# Altium project TutorialBoard.PrjPcb
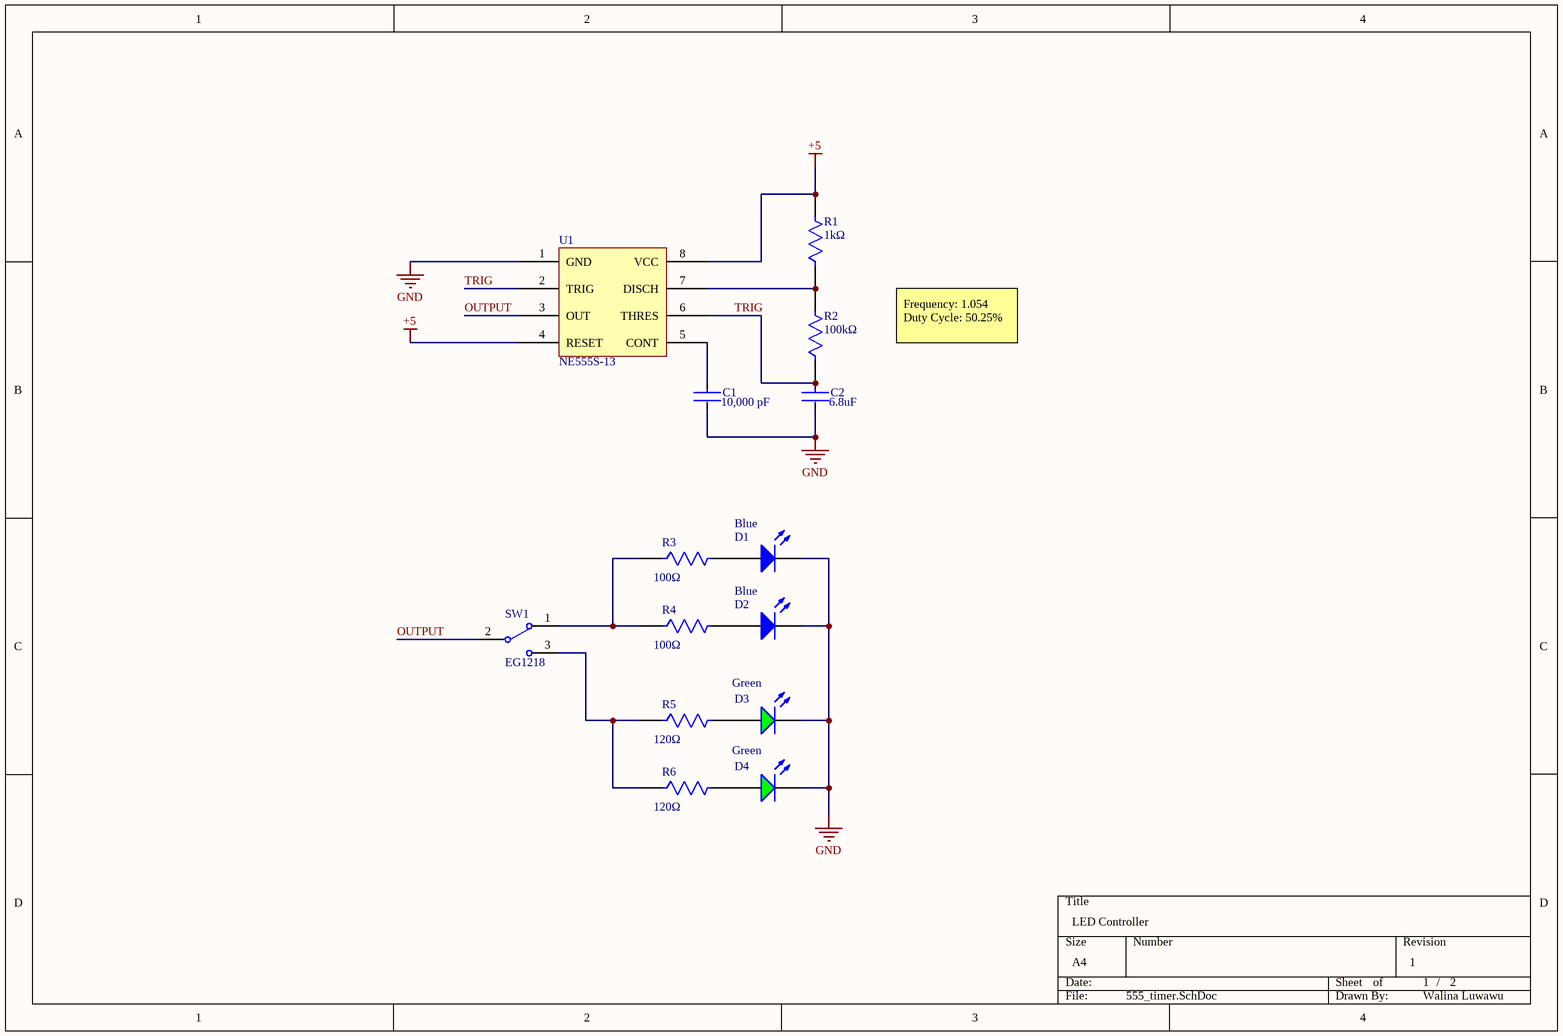
[diagram p0: 555_timer.SchDoc]
2 sheets, 17 parts. Net scope: global (net labels, ports and power ports of the same name join across sheets).
Board file: TutorialBoard.PcbDoc
Sheets:
  555_timer.SchDoc
  Power.SchDoc

## Sheet 555_timer.SchDoc: LED Controller
size A4; DrawnBy: Walina Luwawu; Revision: 1; SheetNumber: 1; SheetTotal: 2

### Parts
C1  Capacitance: 10,000 pF  [FP-C1206C-EB-MFG]  (hidden comment: C1206C103K5RAC7210)
C2  Capacitance: 6.8uF  [FP-CGA4J-IPC_B]  (hidden comment: CGA4J3X7S1A685K125AB)
D1  Color: Blue  [WL-TMRC_D5.9H8.7]  (hidden comment: 151051BS04000)
D2  Color: Blue  [WL-TMRC_D5.9H8.7]  (hidden comment: 151051BS04000)
D3  Color: Green  [WL-TMRC_D3.95H5.3]  (hidden comment: 151031VS06000)
D4  Color: Green  [WL-TMRC_D3.95H5.3]  (hidden comment: 151031VS06000)
R1  Resistance: 1kΩ  [FP-RK73H2A-MFG]  (hidden comment: RK73H2ATTE1001F)
R2  Resistance: 100kΩ  [FP-RR0816-IPC_A]  (hidden comment: RR0816P-104-D)
R3  Resistance: 100Ω  [FP-CR0805-IPC_B]  (hidden comment: CR0805-JW-101ELF)
R4  Resistance: 100Ω  [FP-CR0805-IPC_B]  (hidden comment: CR0805-JW-101ELF)
R5  Resistance: 120Ω  [FP-CRGCQ0805-IPC_C]  (hidden comment: CRGCQ0805F120R)
R6  Resistance: 120Ω  [FP-CRGCQ0805-IPC_C]  (hidden comment: CRGCQ0805F120R)
SW1  EG1218  [ESWI-EG1218_V]
U1  NE555S-13  [NE555S-13]

### Nets
+5: R1.2 U1.4(RESET) U1.8(VCC)
GND: C1.2 C2.2 D1.2(K) D2.2(K) D3.2(K) D4.2(K) U1.1(GND)
OUTPUT: SW1.2(COM) U1.3(OUT)
TRIG: C2.1 R2.1 U1.2(TRIG) U1.6(THRES)
NetC1_1: C1.1 U1.5(CONT)
NetD1_1: D1.1(A) R3.2
NetD2_1: D2.1(A) R4.2
NetD3_1: D3.1(A) R5.2
NetD4_1: D4.1(A) R6.2
NetR1_1: R1.1 R2.2 U1.7(DISCH)
NetR3_1: R3.1 R4.1 SW1.1
NetR5_1: R5.1 R6.1 SW1.3

### Notes on the sheet
- Frequency: 1.054
  Duty Cycle: 50.25%
- /

### Library data of the parts
C1 = CMP-03020-021901-1: CAP CER 10000PF 50V X7R 1206; Manufacturer: KEMET; Description: C1206 10,000 pF X7R 10.00% 50 V; Material: Ceramic; Automotive Grade: Grade 0; Tolerance: 0.1; Temperature Coefficient: 15%; Value: 10,000 pF; ComponentLink2URL: https://content.kemet.com/datasheets/KEM_C1007_X8R_ULTRA_150C_SMD.pdf; Device Class L3: Ceramic Capacitors; Manufacturer Part Number: C1206C103K5RAC7210; Device Class L1: Passive Components; Device Class L2: Capacitors; Digikey Description: CAP CER 10000PF 50V X7R 1206; Temperature Characteristic: X7R; Ipc Land Pattern Name: CAPC320160X78; Automotive: Yes; Voltage Rating: 50 V; Height: 0.88mm; RoHS: TRUE; ComponentLink2Description: Datasheet; Temperature: -55°C to +150°C; Category: Cap; Package: C1206C-EB; Octopart: https://octopart.com/c1206c103k5rac7210-kemet-3918401; Lead Free: Yes; Temperature Range High: +150°C; Temperature Range Low: -55°C; Mouser Description: Multilayer Ceramic Capacitors MLCC - SMD/SMT 50volts 10000pF X7R 10%
C2 = CMP-08246-001055-1: Cap Ceramic 6.8uF 10V X7S 10% Pad SMD 0805 +125°C Automotive T/R; Tolerance: 10%; Height: 1.25mm; Length: 2mm; Min Operating Temperature: -55°C; Case Code (Imperial): 0805; Dielectric: X7S; Case Code (Metric): 2012; Case/Package: 0805; Voltage Rating (DC): 10V; Termination: SMD/SMT; Weight: 0.000194oz; Width: 1.25mm; Max Operating Temperature: 125°C; Package Quantity: 2000; Packaging: Tape and Reel
D1 D2 = CMP-1488-00009-3: Single Color LED, Blue, Diffused, T-1 3/4, 4.9mm; Manufacturer Lifecycle Status: ACTIVE; YEOL: 1 = Estimated lifetime > 10 years; Forward Current: 100mA; Viewing Angle: 40°; Max Reverse Voltage (DC): 5V; Forward Voltage: 3.2V; Lens Size: 5mm; Wavelength: 470nm; Test Current: 20mA; Peak Wavelength: 465nm; Luminous Intensity: 500mcd; Lens Style: Circular, Diffused, Round; Case/Package: Radial; RoHS: Compliant; Width: 5mm; REACH SVHC: Unknown; Max Operating Temperature: 85°C; Mount: Through Hole; Height: 8.6mm; Length: 5mm; Min Operating Temperature: -40°C; Lifecycle Status: Production; Dominant Wavelength: 470nm; Packaging: Bulk
D3 D4 = CMP-1488-00004-3: Led, Green, T-1 (3Mm), 568 Nm, 2.2 V, 30 Ma, 20 Mcd Rohs Compliant: Yes; Manufacturer Lifecycle Status: ACTIVE; Test Current: 20mA; Wavelength: 568nm; Forward Voltage: 2.2V; Viewing Angle: 60°; Lens Style: Circular, Diffused, Round; Max Reverse Voltage (DC): 5V; YEOL: 1 = Estimated lifetime > 10 years; Forward Current: 100mA; Peak Wavelength: 560nm; Luminous Intensity: 30mcd; Case/Package: Radial; Lifecycle Status: Production; Height: 5.3mm; Min Operating Temperature: -40°C; Length: 3mm; RoHS: Compliant; Max Operating Temperature: 85°C; Dominant Wavelength: 568nm; Mount: Through Hole; Lead Free: Lead Free; Lens Size: 3mm; Width: 3mm; Packaging: Bulk; REACH SVHC: Unknown
R1 = CMP-2001-01881-2: 1kΩ ±1% 0.25W Chip Resistor 0805 Thick Film AEC-Q200 Qualified; Manufacturer Series: RK73H; Power Rating: 125mW; Temperature Coefficient: 100ppm/°C; Voltage Rating: 150V; Additional Feature: PRECISION; Package Quantity: 4000; Height: 0.5mm; Construction: Rectangular; Case Code (Imperial): 0805; Size Code: 0805; Length: 2mm; Resistor Type: Thick Film; Min Operating Temperature: -55°C; Packaging: Tape and Reel; Package Shape: Rectangular; Max Operating Temperature: 155°C; Lead Free: Lead Free; Case/Package: 0805; Terminal Finish: Tin; Case Code (Metric): 2012; Military Standard: Not; Series: RK73H; Tolerance: 1%; Depth: 1.25mm; Width: 1.25mm; Technology: METAL GLAZE/THICK FILM; RoHS Compliant: Yes; Termination: SMD/SMT; Working Voltage: 150V
R2 = CMP-2000-02426-2: 100kΩ ±0.5% 0.0625W 1/16W Chip Resistor 0603 (1608 Metric) Thin Film; Max Power Dissipation: 63mW; Working Voltage: 75V; Temperature Coefficient: 25ppm/°C; Technology: THIN FILM; Width: 0.8mm; Length: 1.6mm; Number of Pins: 2; Case Code (Metric): 1608; Tolerance: 0.5%; Case Code (Imperial): 0603; Resistor Type: Thin Film; Voltage Rating (DC): 75V; Lead Free: Lead Free; Max Operating Temperature: 125°C; Series: RR; Voltage Rating: 75V; Termination: SMD/SMT; Depth: 0.8mm; Power Rating: 63mW; Min Operating Temperature: -55°C; Packaging: Tape and Reel; Height: 0.4mm; Package Quantity: 1; RoHS Compliant: Yes; Number of Terminations: 2; Resistance Tolerance: 0.5%; Case/Package: 0603
R3 R4 = CMP-07231-002659-1: Thick Film Chip Resistors 0805 100Ω 0.125W 5% 200ppm/°C; Voltage Rating (DC): 150V; Power Rating: 125mW; Width: 1.25mm; Contact Plating: Tin; Case/Package: 0805; Tolerance: 5%; Termination: SMD/SMT; Case Code (Imperial): 0805; Min Operating Temperature: -55°C; Packaging: Tape and Reel; Height: 0.024inch; REACH SVHC: No SVHC; Composition: Thick Film; Voltage Rating: 150V; Case Code (Metric): 2012; Temperature Coefficient: 200ppm/°C; Max Operating Temperature: 155°C; Mount: Surface Mount; Package Quantity: 1; Features: Moisture Resistant; Max Power Dissipation: 125mW; Military Standard: Not; Depth: 1.25mm; Number of Terminations: 2; Thickness: 508um; Length: 2mm
R5 R6 = CMP-03211-008258-1: CRGCQ 0805 120R 1%; Manufacturer: TE Connectivity; Value: 120Ω; Voltage Rating: 150V; Tolerance: 0.01; Temperature Coefficient: ±100ppm/°C; Description: CRGCQ0805 120Ω 0.125W ±100ppm/°C 1% 150V; Automotive Grade: Grade 473; Power Rating: 0.125W; Device Class L1: Passive Components; Manufacturer Part Number: CRGCQ0805F120R; ComponentLink2Description: Datasheet; Package: CRGCQ0805; ComponentLink2URL: https://www.te.com/commerce/DocumentDelivery/DDEController?Action=showdoc&DocId=Data+Sheet%7F1773204-3%7F1%7Fpdf%7FEnglish%7FENG_DS_1773204-3_1.pdf%7F4-2176341-482; RoHS: TRUE; Octopart: https://octopart.com/crgcq0805f120r-te+connectivity-91018143; Temperature: -55°C to +155°C; Digikey Description: CRGCQ 0805 120R 1%; Height: 0.65mm; Lead Free: Yes; Automotive: Yes; Temperature Range Low: -55°C; Device Class L2: Resistors; Ipc Land Pattern Name: RESC200125X55; Ambient Temperature Range High: +70°C; Device Class L3: Chip SMD Resistors; Series: CRGCQ; Category: Res; Temperature Range High: +155°C; Composition: Thick Film
SW1 = CMP-1696-00002-1: Slide Switch, 500 V, -20 to 70 degC, 3-Pin THD, RoHS; Case\Package: SOT-23-5; Output Current: 150 mA; Nominal Output Voltage: 3.3 V; Max Power Dissipation: 250 mW; Min Input Voltage: 4.3 V; Outputs: 1; Max Input Voltage: 8 V; Dropout Voltage: 300 mV; PackageDescription: 3-Pin Through Hole Device, Body 11.6 x 4 mm, Pitch 2.5 mm; ComponentLink1URL: http://www.e-switch.ch/en/; RoHSCompliant: true; Length: 3 mm; ComponentLink1Description: Manufacturer URL; Power Rating: 250 mW; Mount: Surface Mount; Max Operating Temperature: 85 degC; REACH SVHC: No SVHC; Radiation Hardening: No; Height: 1.3 mm; Pins: 5; Max Ouput Current: 150 mA; Output Voltage: 3.3 V; Width: 1.8 mm; Package Quantity: 3000; ComponentLink2URL: https://www.e-switch.com/system/asset/product_line/data_sheet/119/EG.pdf; Min Operating Temperature: -40 degC; ComponentLink2Description: Datasheet; DatasheetVersion: Oct-15; PackageReference: EG1218; Packaging: Tape and Reel
U1 = NE555S-13: IC OSC SNGL TIMER 500KHZ 8-SOIC; Supplier 1: Newark; Supplier Part Number 1: NE555S-13

## Sheet Power.SchDoc: LED Power Source
size A4; DrawnBy: Walina Luwawu; Revision: 1; SheetNumber: 2; SheetTotal: 2
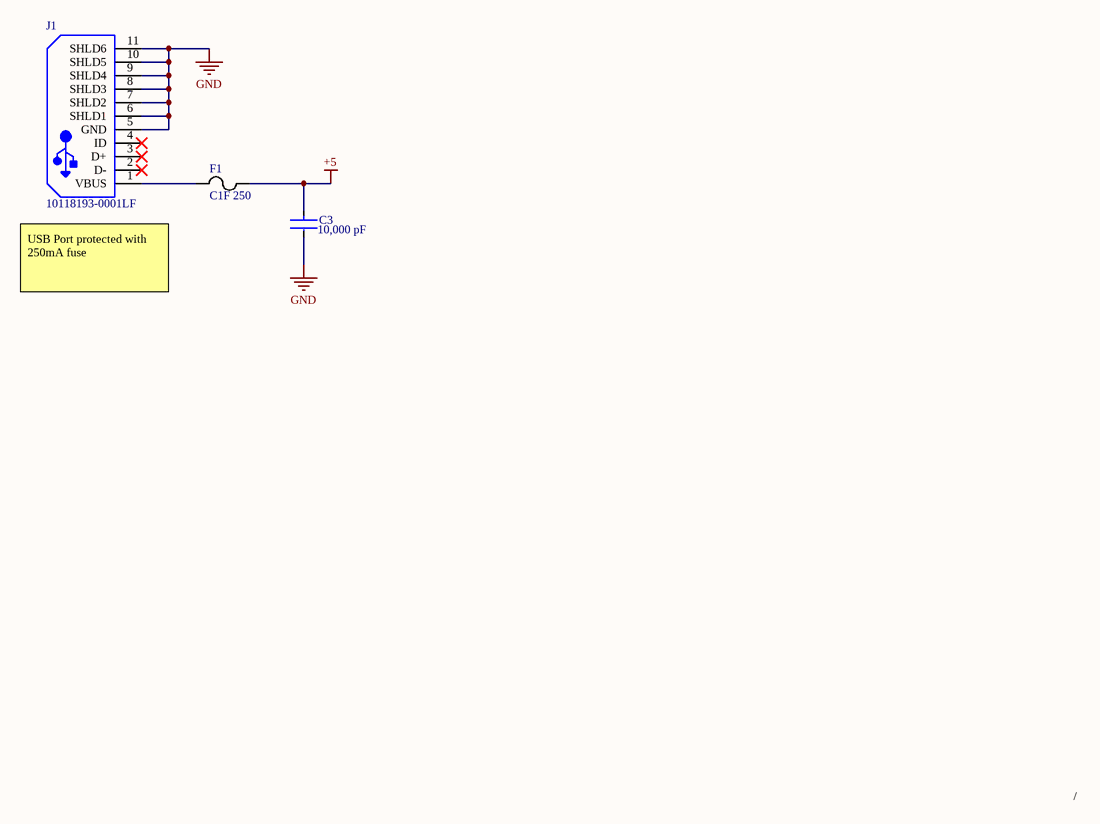
[diagram p1: Power.SchDoc]

### Parts
C3  Capacitance: 10,000 pF  [FP-C1206C-EB-MFG]  (hidden comment: C1206C103K5RAC7210)
F1  C1F 250  [C1_BEL]
J1  10118193-0001LF  [FCI-10118193-0001LF-5_V]

### Nets
+5: C3.1 F1.2
GND: C3.2 J1.5(GND) J1.6(SHLD1) J1.7(SHLD2) J1.8(SHLD3) J1.9(SHLD4) J1.10(SHLD5) J1.11(SHLD6)
NetF1_1: F1.1 J1.1(VBUS)

Not connected (* = marked no-connect by the designer): J1 2(D-)* 3(D+)* 4(ID)*

### Notes on the sheet
- USB Port protected with 250mA fuse
- /

### Library data of the parts
C3 = CMP-03020-021901-1: as C1 on sheet 555_timer; ComponentLink2URL: https://content.kemet.com/datasheets/KEM_C1007_X8R_ULTRA_150C_SMD.pdf; Device Class L3: Ceramic Capacitors; Manufacturer Part Number: C1206C103K5RAC7210; Device Class L1: Passive Components; Device Class L2: Capacitors; Digikey Description: CAP CER 10000PF 50V X7R 1206; Temperature Characteristic: X7R; Ipc Land Pattern Name: CAPC320160X78; Automotive: Yes; Voltage Rating: 50 V; Height: 0.88mm; RoHS: TRUE; ComponentLink2Description: Datasheet; Temperature: -55°C to +150°C; Category: Cap; Package: C1206C-EB; Octopart: https://octopart.com/c1206c103k5rac7210-kemet-3918401; Lead Free: Yes; Temperature Range High: +150°C; Temperature Range Low: -55°C; Mouser Description: Multilayer Ceramic Capacitors MLCC - SMD/SMT 50volts 10000pF X7R 10%
F1 = C1F 250: Description; Manufacturer_Name: Belfuse; Copyright: Copyright (C) 2026 Ultra Librarian. All rights reserved.; Manufacturer_Part_Number: C1F 250
J1 = CMP-2000-05119-1: Micro USB B Type Receptacle, -55 to 85 degC, 5-Pin SMD, RoHS, Tape and Reel; Manufacturer: FCI; Insulation Resistance: 1000MOhms; Gender: Female; Current Rating: 1.8A; Number of Contacts: 5Contact; Connector Type: MicroUSBTypeBreceptacle; Mounting Angle: Right; Datasheet Version: Rev. C, 05/2015; Packaging: Reel; Product Category: USBConnectors; Standard: USB2.0; Factory Pack Quantity: 1200; Operating Temperature Range: -55Cto+85C; Termination Style: SMD/SMT; Datasheet URL: http://datasheet.octopart.com/10118193-0001LF-FCI-datasheet-55953155.pdf; Contact Material: CopperAlloy; RoHS: Details; Contact Plating: Gold; Flammability Rating: UL94V-0; Manufacturer URL: http://www.fci.com/; Brand: FCI; Product: MicroUSBTypeBConnectors; Color: Black

## Nets that join several sheets
+5: 555_timer (R1.2 U1.4 U1.8), Power (C3.1 F1.2)
GND: 555_timer (7 pins), Power (8 pins)